# Altium schematic sheet Block_Diagram.SchDoc
size A3; SheetNumber: 1; SheetTotal: 22
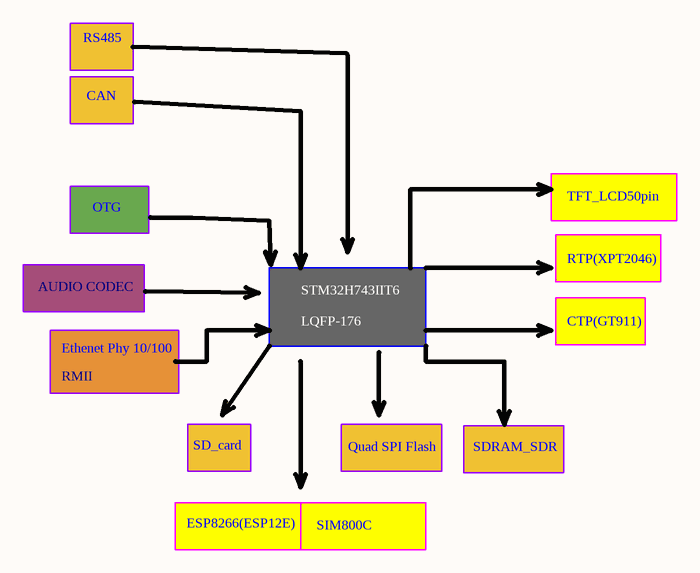
[diagram p0: Block_Diagram.SchDoc]

## Notes on the sheet
- RS485
- CAN
- OTG
- TFT_LCD50pin
- AUDIO CODEC
- STM32H743IIT6
- LQFP-176
- RTP(XPT2046)
- CTP(GT911)
- Ethenet Phy 10/100
- RMII
- SD_card
- Quad SPI Flash
- SDRAM_SDR
- ESP8266(ESP12E)
- SIM800C